# Altium schematic sheet Sheet1.SchDoc
size A4
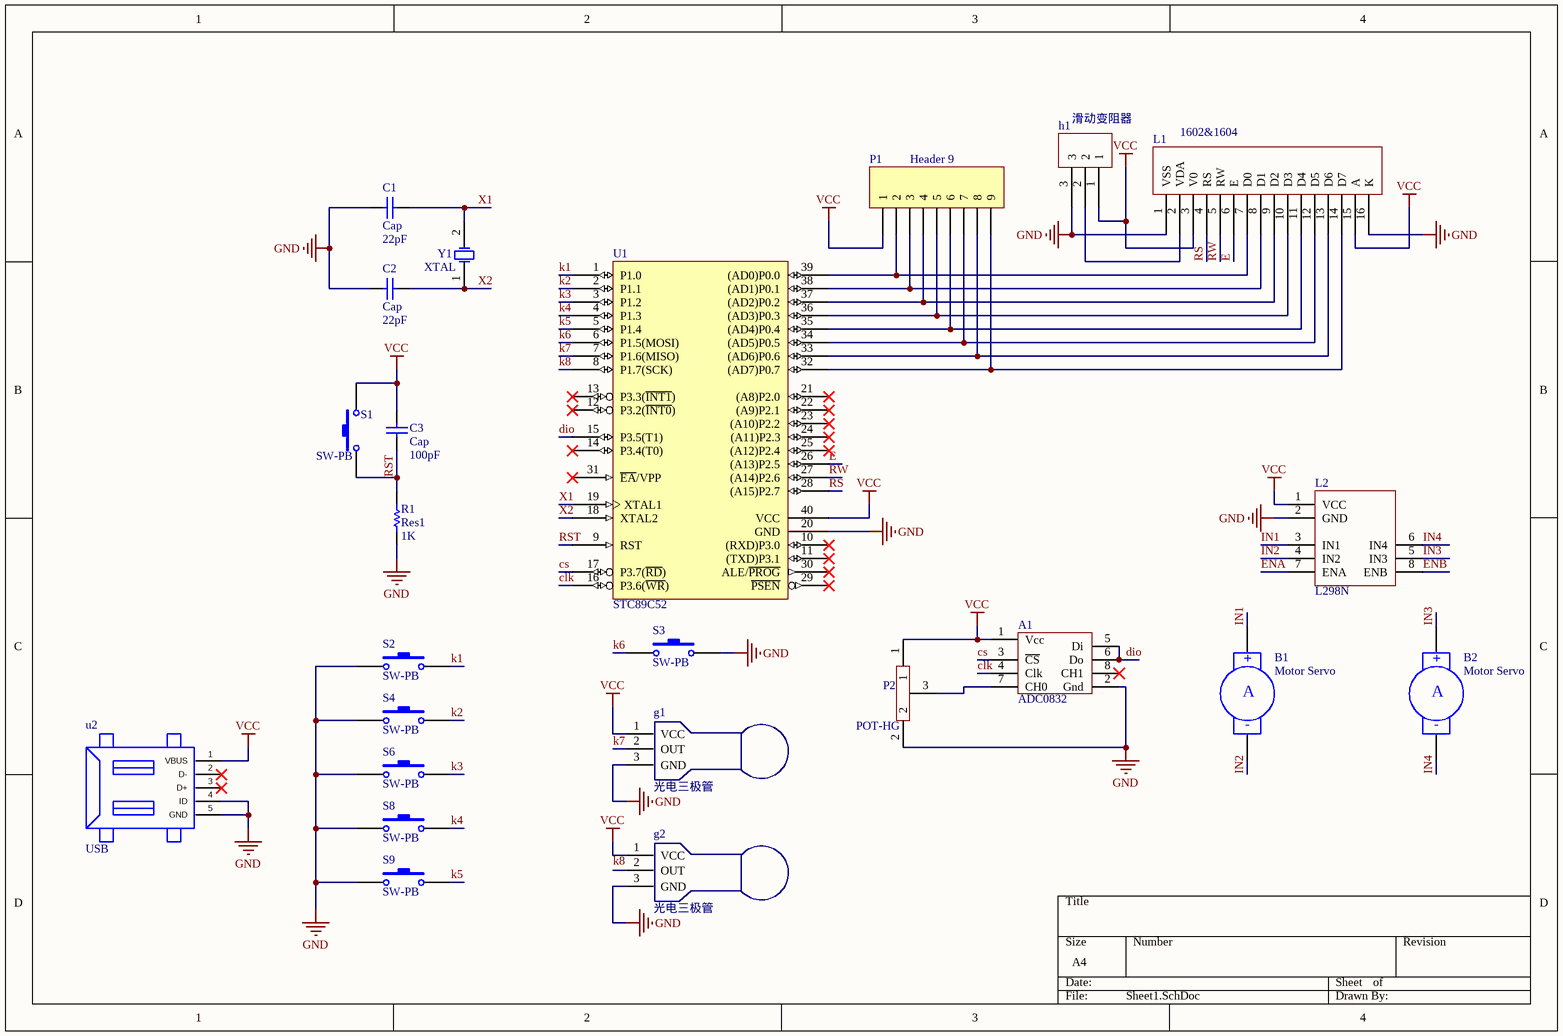
[diagram p0: Sheet1.SchDoc]

## Parts
A1  ADC0832
B1  Motor Servo  [RAD-0.4]
B2  Motor Servo  [RAD-0.4]
C1  Cap  value 22pF  [RAD-0.3]
C2  Cap  value 22pF  [RAD-0.3]
C3  Cap  value 100pF  [RAD-0.3]
g1  光电三极管
g2  光电三极管
h1  滑动变阻器
L1  1602&1604
L2  L298N
P1  Header 9  [HDR1X9]
P2  POT-HG
R1  Res1  value 1K  [AXIAL-0.3]
S1  SW-PB  [SPST-2]
S2  SW-PB  [SPST-2]
S3  SW-PB  [SPST-2]
S4  SW-PB  [SPST-2]
S6  SW-PB  [SPST-2]
S8  SW-PB  [SPST-2]
S9  SW-PB  [SPST-2]
U1  STC89C52  [DIP-40]
u2  USB
Y1  XTAL  [R38]

## Nets
GND: A1.2(Gnd) C1.1 C2.1 g1.3(GND) g2.3(GND) h1.3 L1.1(VSS) L1.16(K) L2.2(GND) P2.2 R1.1 S2.1 S3.2 S4.1 S6.1 S8.1 S9.1 U1.20(GND) u2.4(ID) u2.5(GND)
VCC: A1.1(Vcc) C3.2 g1.1(VCC) g2.1(VCC) h1.1 L1.3(V0) L1.15(A) L2.1(VCC) P1.1 P2.1 S1.2 U1.40(VCC) u2.1(VBUS)
clk: A1.4(Clk) U1.16(P3.6(~{WR}))
cs: A1.3(~{CS}) U1.17(P3.7(~{RD}))
dio: A1.5(Di) A1.6(Do) U1.15(P3.5(T1))
E: L1.6(E) U1.26((A13)P2.5)
ENA: L2.7(ENA)
ENB: L2.8(ENB)
IN1: B1.1(+) L2.3(IN1)
IN2: B1.2(-) L2.4(IN2)
IN3: B2.1(+) L2.5(IN3)
IN4: B2.2(-) L2.6(IN4)
k1: S2.2 U1.1(P1.0)
k2: S4.2 U1.2(P1.1)
k3: S6.2 U1.3(P1.2)
k4: S8.2 U1.4(P1.3)
k5: S9.2 U1.5(P1.4)
k6: S3.1 U1.6(P1.5(MOSI))
k7: g1.2(OUT) U1.7(P1.6(MISO))
k8: U1.8(P1.7(SCK))
RS: L1.4(RS) U1.28((A15)P2.7)
RST: C3.1 R1.2 S1.1 U1.9(RST)
RW: L1.5(RW) U1.27((A14)P2.6)
X1: C1.2 U1.19(XTAL1) Y1.2(OSC2)
X2: C2.2 U1.18(XTAL2) Y1.1(OSC1)
NetA1_7: A1.7(CH0) P2.3
Neth1_2: h1.2 L1.2(VDA)
NetL1_7: L1.7(D0) P1.2 U1.39((AD0)P0.0)
NetL1_8: L1.8(D1) P1.3 U1.38((AD1)P0.1)
NetL1_9: L1.9(D2) P1.4 U1.37((AD2)P0.2)
NetL1_10: L1.10(D3) P1.5 U1.36((AD3)P0.3)
NetL1_11: L1.11(D4) P1.6 U1.35((AD4)P0.4)
NetL1_12: L1.12(D5) P1.7 U1.34((AD5)P0.5)
NetL1_13: L1.13(D6) P1.8 U1.33((AD6)P0.6)
NetL1_14: L1.14(D7) P1.9 U1.32((AD7)P0.7)

Not connected (* = marked no-connect by the designer): A1 8(CH1)*; g2 2(OUT); U1 10((RXD)P3.0)* 11((TXD)P3.1)* 12(P3.2(~{INT0}))* 13(P3.3(~{INT1}))* 14(P3.4(T0))* 21((A8)P2.0)* 22((A9)P2.1)* 23((A10)P2.2)* 24((A11)P2.3)* 25((A12)P2.4)* 29(~{PSEN})* 30(ALE/~{PROG})* 31(~{EA}/VPP)*; u2 2(D-)* 3(D+)*

## Notes on the sheet
- Labels drawn without touching a wire or pin: k8
- (in symbol Motor Servo) A

## Library data of the parts
B1 B2 = Motor Servo: Servo Motor; Published: 24-Mar-1999; LatestRevisionDate: 17-Jul-2002; LatestRevisionNote: Re-released for DXP Platform.; PackageReference: RAD-0.4; Publisher: Altium Limited; PackageDescription: Radial Cap, Thru-Hole; 2 Leads; 0.4 in Pin Spacing
C1-C3 = Cap: Capacitor; Published: 8-Jun-2000; LatestRevisionDate: 17-Jul-2002; LatestRevisionNote: Re-released for DXP Platform.; PackageReference: RAD-0.3; Publisher: Altium Limited; PackageDescription: Radial Cap, Thru-Hole; 2 Leads; 0.3 in Pin Spacing
P1 = Header 9: Header, 9-Pin; LatestRevisionDate: 17-Jul-2002; LatestRevisionNote: Re-released for DXP Platform.; Publisher: Altium Limited
R1 = Res1: Resistor; Published: 8-Jun-2000; LatestRevisionDate: 17-Jul-2002; LatestRevisionNote: Re-released for DXP Platform.; PackageReference: AXIAL-0.3; Publisher: Altium Limited; PackageDescription: Axial Device, Thru-Hole; 2 Leads; 0.3 in Pin Spacing
S1-S4 S6 S8 S9 = SW-PB: Switch; Published: 24-Mar-1999; LatestRevisionDate: 17-Jul-2002; LatestRevisionNote: Re-released for DXP Platform.; PackageReference: SPST-2; Publisher: Altium Limited
  S1: PackageDescription: Switch; 2 Leads
U1 = AT89S51: 8-Bit Microcontroller with 4K ISP Flash ROM
Y1 = XTAL: Crystal Oscillator; Published: 8-Jun-2000; LatestRevisionDate: 17-Jul-2002; LatestRevisionNote: Re-released for DXP Platform.; PackageReference: R38; Publisher: Altium Limited; PackageDescription: Crystal, Thru-Hole; 2 Leads; Body 3.1 x 8.2 mm (Dia.xH)